# EAGLE board ESC_BOARD_NEW (EAGLE 8.5.0)
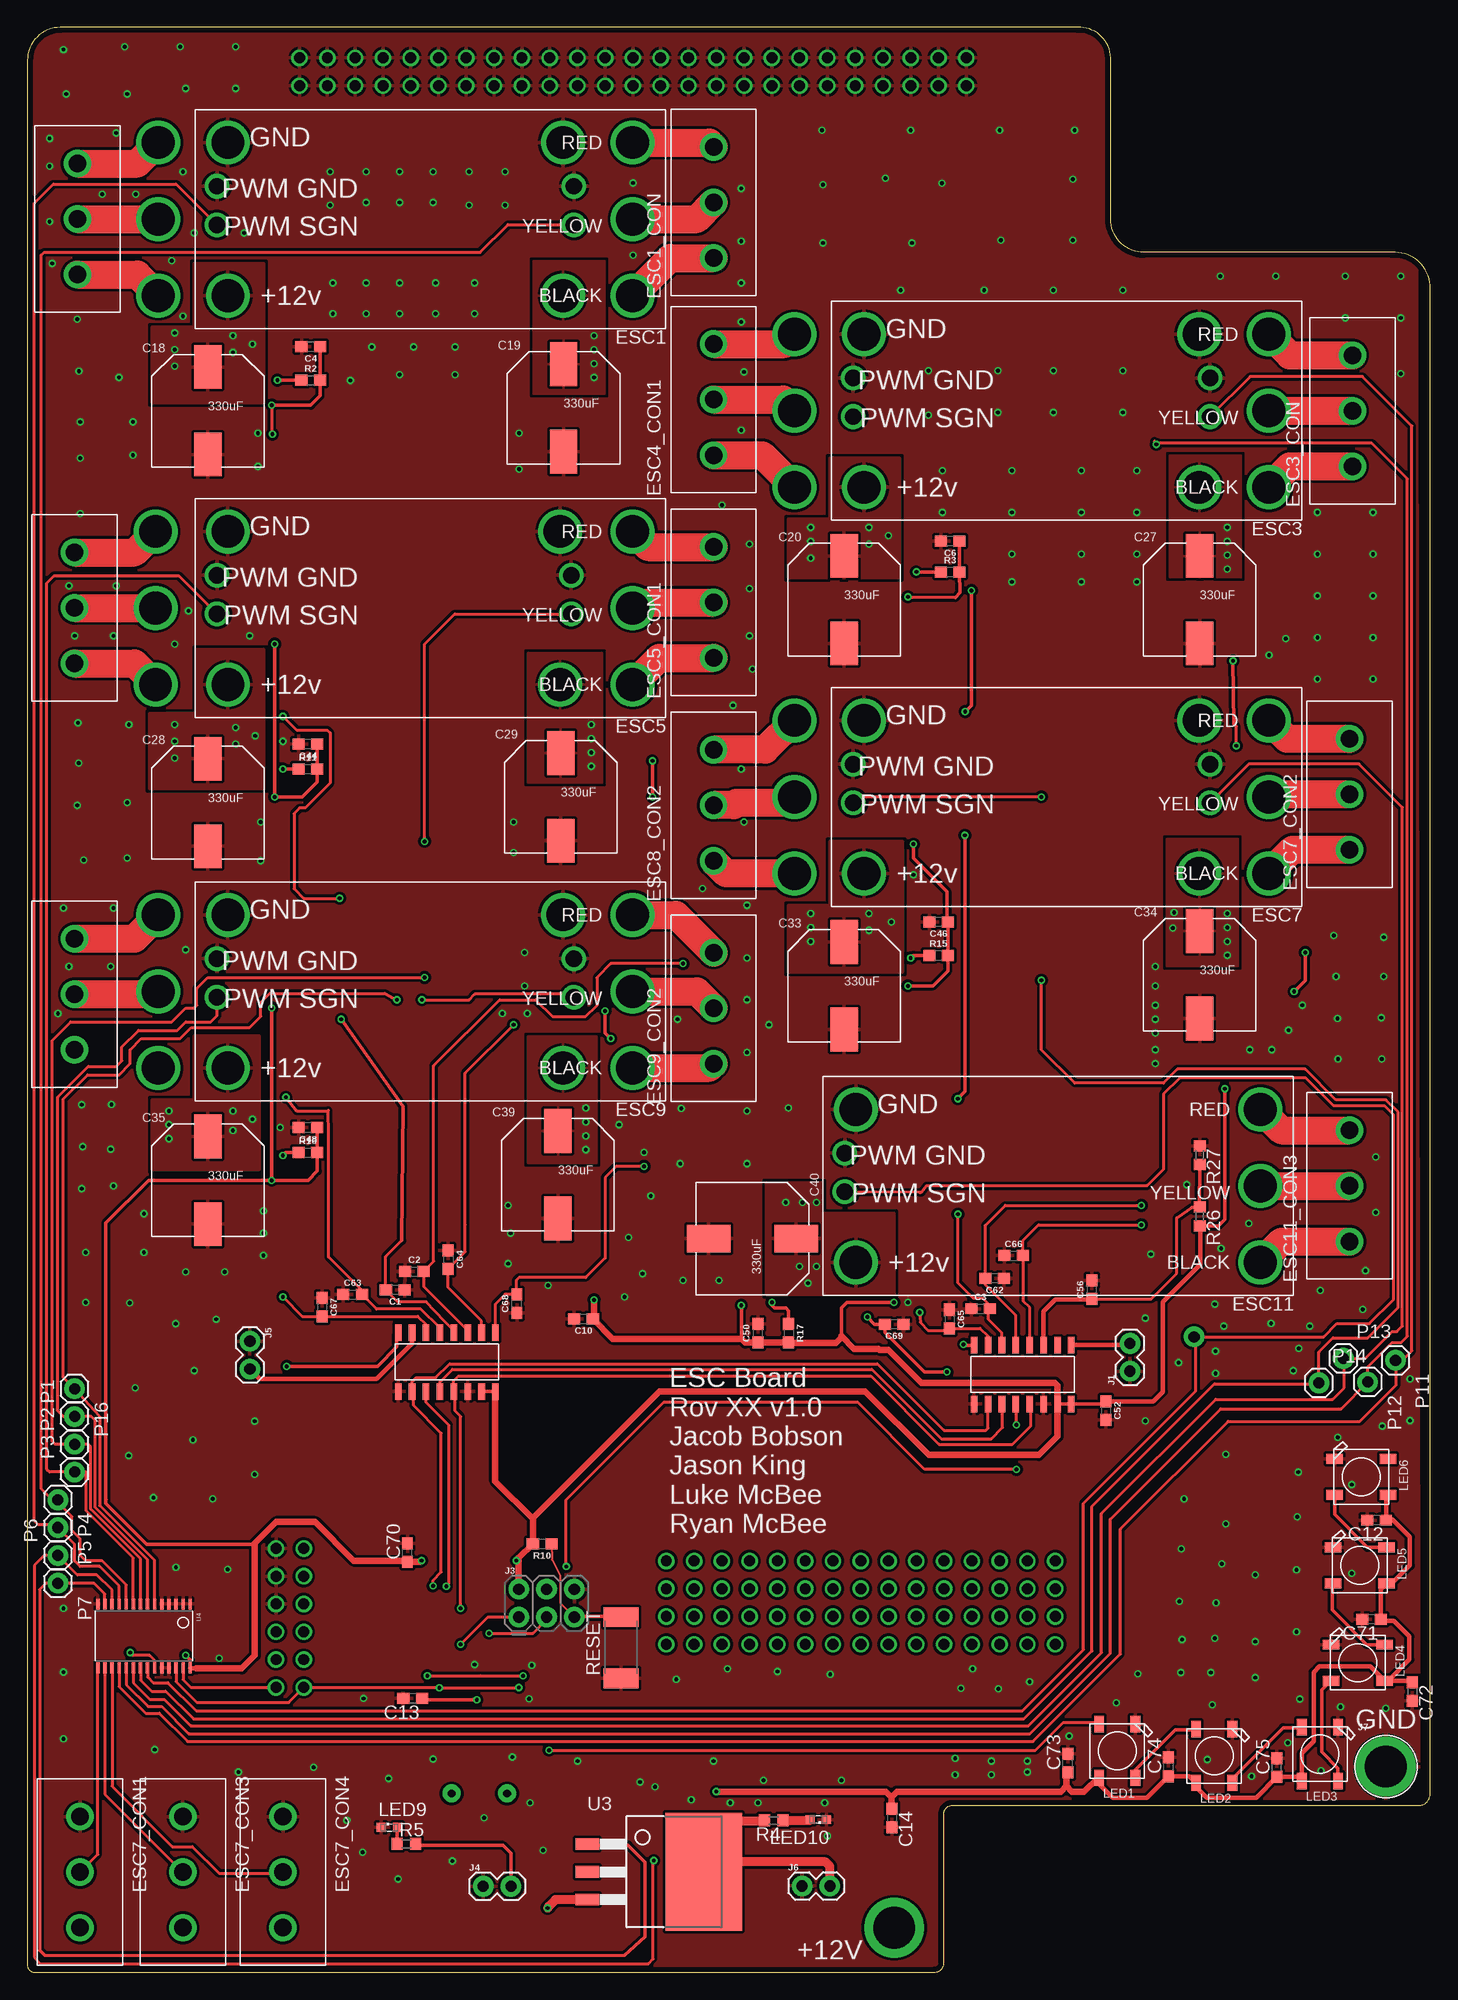
[diagram p2: board, top side]
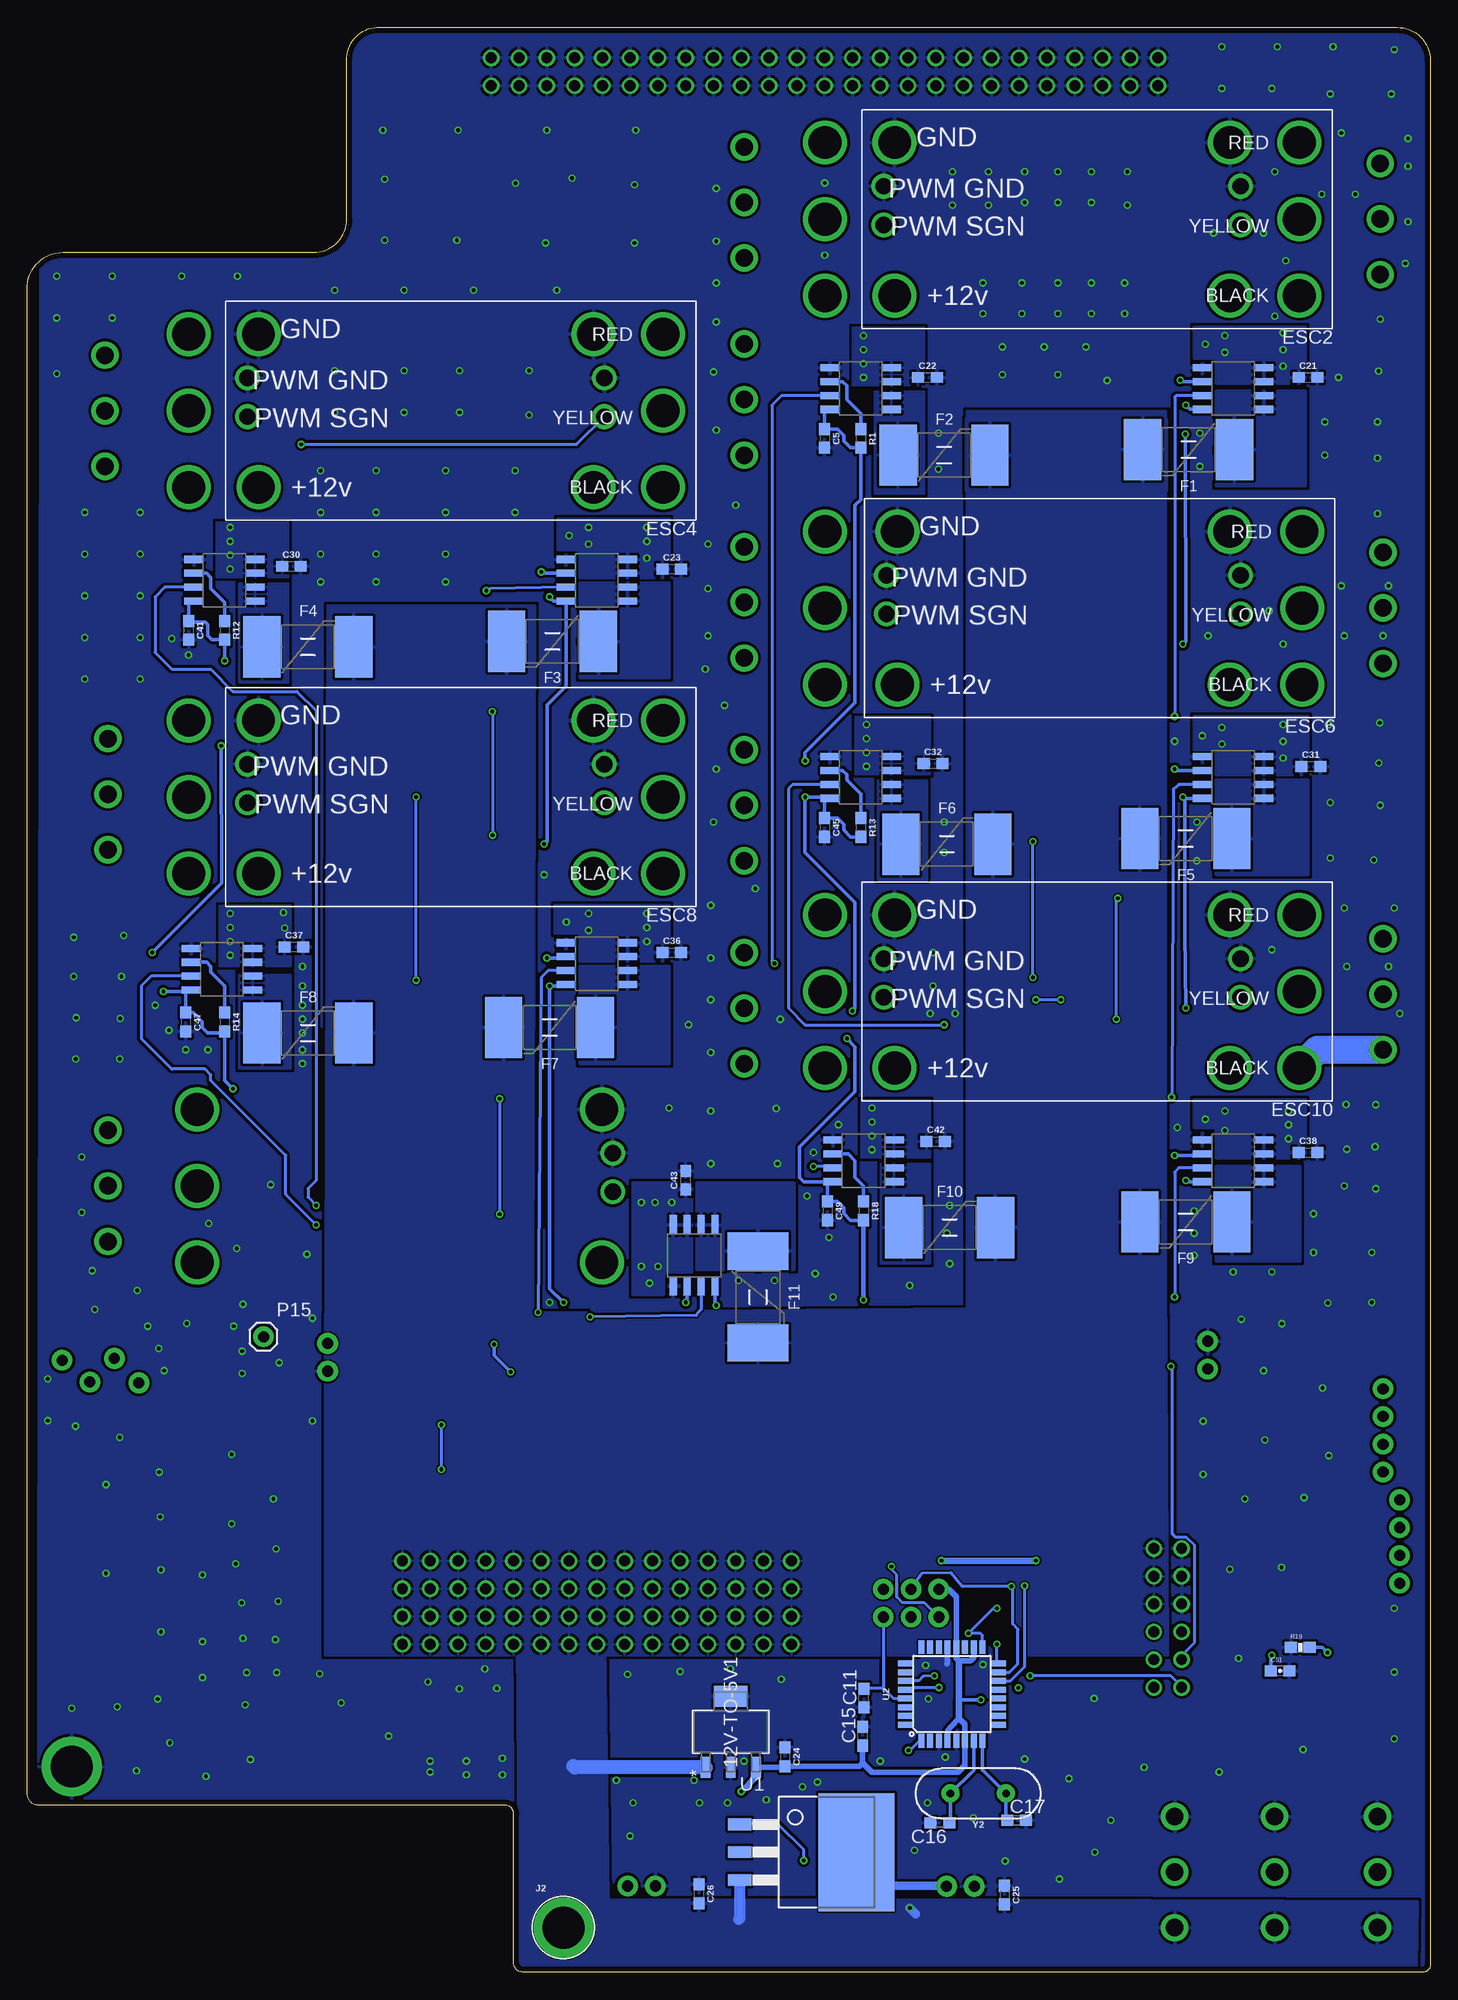
[diagram p3: board, bottom side, seen from below]

Size 128.27 x 177.8 mm. Coordinates in mm from the lower left corner, seen from the top.
Outline: 96.04,177.8 3.03,177.8 arc90 0,174.77 0,0.65 arc90 0.65,0 82.95,0 arc90 83.82,0.87 83.82,14.37 arc-90 84.43,15.24 127.2,15.24 arc90 128.27,16.31 128.27,154.21 arc90 124.75,157.23 102.08,157.23 arc-90 99.06,160.25 99.06,175.04 arc90 96.04,177.8
Copper layers (1*16): Top 0.035mm / dielectric 1.6mm / Bottom 0.035mm
Design rules "Elecrow_2-layer_PCB_eagle_rule": minimum track width 6mil, minimum drill 12mil, track to track 6mil, track to pad 6mil, pad to pad 6mil, via to via 8mil, smd to smd 0mil, copper to edge 20mil, drill to drill 10mil, minimum pad ring 6mil, minimum via ring 6mil, stop-mask expansion 0mil, vias tented up to drill 100mil, thermal gap 10mil

## Footprints (pad centres in the part's own frame; a part is rotated, then mirrored left to right if it is on the bottom)
MP04A-M = smd 1.905 x 0.889: 1 -3.251,2.3; 2 -3.251,0; 3 -3.251,-2.3 | smd 1.905 x 3.099: 4 3.251,0
0603 = smd 1.1 x 1: 1 -0.85,0; 2 0.85,0
C0603 = smd 1.1 x 1: 1 -0.85,0; 2 0.85,0
CPOL-US(10.3_10.3MM) = smd 2.5 x 4: + 0,4; - 0,-4
0603-CAP = smd 1.1 x 1: 1 -0.85,0; 2 0.85,0
AFRO_20A_ESC = drill 3: BLK -18,7; GND 19,-7; RED -18,-7; VCC 19,7; YEL -18,0 | drill 1.5: PWM_GND 20,-3; PWM_SGN 20,0.54
3PINCONNECTOR = drill 1.6 pad 2.5: A -5.08,0; B 0,0; C 5.08,0
PTC-2920 = smd 3.4 x 5.6: 1 -4.2,0; 2 4.2,0
1X02 = drill 1.016 pad 1.88: 1 0,0; 2 2.54,0
BANANA_CONN = drill 3.81 pad 5.461: P$1 0,0
2X3-NS = drill 1.016 pad 1.88: 1 -2.54,-1.27; 2 -2.54,1.27; 3 0,-1.27; 4 0,1.27; 5 2.54,-1.27; 6 2.54,1.27
WS2812B = smd 1.5 x 0.9: 1-VDD 2.45,-1.65; 2-DOUT 2.45,1.65; 3-GND -2.45,1.65; 4-DIN -2.45,-1.65
SML0603 = smd 0.8 x 0.8: A 0.75,0; C -0.75,0
1X01 = drill 1.016 pad 1.88: 1 0,0
R0603 = smd 1 x 1.1: 1 -0.85,0; 2 0.85,0
0603-RES = smd 1.1 x 1: 1 -0.85,0; 2 0.85,0
SW_2512 = smd 1.8 x 3.2: 1 -2.8,0; 2 2.8,0
TO263-3 = smd 1.067 x 2.159: 1 -2.54,-5.08; 2 0,-5.08; 3 2.54,-5.08 | smd 10.795 x 6.985: TAB 0,5.601
TQFP32-08 = smd 1.27 x 0.559: 1 -4.293,2.8; 2 -4.293,2; 3 -4.293,1.2; 4 -4.293,0.4; 5 -4.293,-0.4; 6 -4.293,-1.2; 7 -4.293,-2; 8 -4.293,-2.8; 17 4.293,-2.8; 18 4.293,-2; 19 4.293,-1.2; 20 4.293,-0.4; 21 4.293,0.4; 22 4.293,1.2; 23 4.293,2; 24 4.293,2.8 | smd 0.559 x 1.27: 9 -2.8,-4.293; 10 -2,-4.293; 11 -1.2,-4.293; 12 -0.4,-4.293; 13 0.4,-4.293; 14 1.2,-4.293; 15 2,-4.293; 16 2.8,-4.293; 25 2.8,4.293; 26 2,4.293; 27 1.2,4.293; 28 0.4,4.293; 29 -0.4,4.293; 30 -1.2,4.293; 31 -2,4.293; 32 -2.8,4.293
TSSOP28 = smd 0.305 x 0.991: 1 -4.225,-2.918; 2 -3.575,-2.918; 3 -2.925,-2.918; 4 -2.275,-2.918; 5 -1.625,-2.918; 6 -0.975,-2.918; 7 -0.325,-2.918; 8 0.325,-2.918; 9 0.975,-2.918; 10 1.625,-2.918; 11 2.275,-2.918; 12 2.925,-2.918; 13 3.575,-2.918; 14 4.225,-2.918; 15 4.225,2.918; 16 3.575,2.918; 17 2.925,2.918; 18 2.275,2.918; 19 1.625,2.918; 20 0.975,2.918; 21 0.325,2.918; 22 -0.325,2.918; 23 -0.975,2.918; 24 -1.625,2.918; 25 -2.275,2.918; 26 -2.925,2.918; 27 -3.575,2.918; 28 -4.225,2.918
ACS711 = smd 1.75 x 0.65: FAULT 2.8,-0.635; GND 2.8,-1.905; IP1+ -2.8,1.905; IP1- -2.8,-0.635; IP2+ -2.8,0.635; IP2- -2.8,-1.905; VCC 2.8,1.905; VIOUT 2.8,0.635
MCP3008 = smd 0.6 x 1.5: AGND -1.905,2.7; CH0 -4.445,-2.7; CH1 -3.175,-2.7; CH2 -1.905,-2.7; CH3 -0.635,-2.7; CH4 0.635,-2.7; CH5 1.905,-2.7; CH6 3.175,-2.7; CH7 4.445,-2.7; CLK -0.635,2.7; CS/SHDN 3.175,2.7; DGND 4.445,2.7; DIN 1.905,2.7; DOUT 0.635,2.7; VDD -4.445,2.7; VREF -3.175,2.7
ESC-FULL = drill 1: P$1 -6.35,-1.27; P$2 -3.81,-1.27; P$3 -1.27,-1.27; P$4 1.27,-1.27; P$5 3.81,-1.27; P$6 6.35,-1.27; P$7 -6.35,1.27; P$8 -3.81,1.27; P$9 -1.27,1.27; P$10 1.27,1.27; P$11 3.81,1.27; P$12 6.35,1.27; P$13 140.081,-61.849; P$14 142.621,-61.849; P$15 140.081,-59.309; P$16 142.621,-59.309; P$17 140.081,-56.769; P$18 142.621,-56.769; P$19 140.081,-54.229; P$20 142.621,-54.229; P$21 140.081,-51.689; P$22 142.621,-51.689; P$23 140.081,-49.149; P$24 142.621,-49.149; P$25 140.081,-46.609; P$26 142.621,-46.609; P$27 140.081,-44.069; P$28 142.621,-44.069; P$29 140.081,-41.529; P$30 142.621,-41.529; P$31 140.081,-38.989; P$32 142.621,-38.989; P$33 140.081,-36.449; P$34 142.621,-36.449; P$35 140.081,-33.909; P$36 142.621,-33.909; P$37 140.081,-31.369; P$38 142.621,-31.369; P$39 140.081,-28.829; P$40 142.621,-28.829; P$41 140.081,-26.289; P$42 142.621,-26.289; P$43 140.081,-23.749; P$44 142.621,-23.749; P$45 140.081,-21.209; P$46 142.621,-21.209; P$47 140.081,-18.669; P$48 142.621,-18.669; P$49 140.081,-16.129; P$50 142.621,-16.129; P$51 140.081,-13.589; P$52 142.621,-13.589; P$53 140.081,-11.049; P$54 142.621,-11.049; P$55 140.081,-8.509; P$56 142.621,-8.509; P$57 140.081,-5.969; P$58 142.621,-5.969; P$59 140.081,-3.429; P$60 142.621,-3.429; P$61 140.081,-0.889; P$62 142.621,-0.889; P$63 2.667,-34.417; P$64 2.667,-36.957; P$65 2.667,-39.497; P$66 2.667,-42.037; P$67 2.667,-44.577; P$68 2.667,-47.117; P$69 2.667,-49.657; P$70 2.667,-52.197; P$71 2.667,-54.737; P$72 2.667,-57.277; P$73 2.667,-59.817; P$74 2.667,-62.357; P$75 2.667,-64.897; P$76 2.667,-67.437; P$77 2.667,-69.977; P$78 5.207,-34.417; P$79 5.207,-36.957; P$80 5.207,-39.497; P$81 5.207,-42.037; P$82 5.207,-44.577; P$83 5.207,-47.117; P$84 5.207,-49.657; P$85 5.207,-52.197; P$86 5.207,-54.737; P$87 5.207,-57.277; P$88 5.207,-59.817; P$89 5.207,-62.357; P$90 5.207,-64.897; P$91 5.207,-67.437; P$92 5.207,-69.977; P$101 -2.413,-34.417; P$102 -2.413,-36.957; P$103 -2.413,-39.497; P$104 -2.413,-42.037; P$105 -2.413,-44.577; P$106 -2.413,-47.117; P$107 -2.413,-49.657; P$108 -2.413,-52.197; P$109 -2.413,-54.737; P$110 -2.413,-57.277; P$111 -2.413,-59.817; P$112 -2.413,-62.357; P$113 -2.413,-64.897; P$114 -2.413,-67.437; P$115 -2.413,-69.977; P$116 0.127,-34.417; P$117 0.127,-36.957; P$118 0.127,-39.497; P$119 0.127,-42.037; P$120 0.127,-44.577; P$121 0.127,-47.117; P$122 0.127,-49.657; P$123 0.127,-52.197; P$124 0.127,-54.737; P$125 0.127,-57.277; P$126 0.127,-59.817; P$127 0.127,-62.357; P$128 0.127,-64.897; P$129 0.127,-67.437; P$130 0.127,-69.977
HC49US = drill 0.7 pad 1.651: 1 -2.54,0; 2 2.54,0

## Placement (x,y rotation side)
12V-TO-5V1  LM340MPX-5.0/NOPBMP04A-M  [MP04A-M]  63.96,21.97 90 bottom
C1  0.1uF  [0603]  33.63,62.38 180 top
C2  0.1uF  [0603]  35.38,64.06 0 top
C3  0.1uF  [0603]  87.15,60.66 0 top
C4  0.1uF  [0603]  25.91,148.59 180 top
C5  0.1uF  [0603]  55.37,140.21 270 bottom
C6  0.1uF  [0603]  84.38,130.81 180 top
C10  0.1uF  [0603]  50.85,59.72 180 top
C11  0.1uF  [C0603]  51.79,25.04 90 bottom
C12  0.1uF  [C0603]  123.37,41.33 180 top
C13  0.1uF  [C0603]  35.23,25.02 180 top
C14  0.1uF  [C0603]  79.04,14.1 270 top
C15  0.1uF  [C0603]  51.89,21.56 90 bottom
C16  22pF  [C0603]  44.83,13.67 180 bottom
C17  22pF  [C0603]  37.82,13.87 0 bottom
C18  330uF  [CPOL-US(10.3_10.3MM)]  16.51,142.75 0 top
C19  330uF  [CPOL-US(10.3_10.3MM)]  49.02,143 0 top
C20  330uF  [CPOL-US(10.3_10.3MM)]  74.68,125.48 0 top
C21  0.1uF  [0603]  11.18,145.8 0 bottom
C22  0.1uF  [0603]  45.97,145.8 0 bottom
C23  0.1uF  [0603]  69.34,128.27 0 bottom
C24  0.1uF  [0603]  59,19.68 270 bottom
C25  0.1uF  [0603]  38.94,7.06 270 bottom
C26  10uF  [0603]  66.88,7.16 270 bottom
C27  330uF  [CPOL-US(10.3_10.3MM)]  107.19,125.48 0 top
C28  330uF  [CPOL-US(10.3_10.3MM)]  16.51,106.93 0 top
C29  330uF  [CPOL-US(10.3_10.3MM)]  48.77,107.44 0 top
C30  0.1uF  [0603]  104.14,128.52 0 bottom
C31  0.1uF  [0603]  10.92,110.24 0 bottom
C32  0.1uF  [0603]  45.47,110.49 0 bottom
C33  330uF  [CPOL-US(10.3_10.3MM)]  74.68,90.17 0 top
C34  330uF  [CPOL-US(10.3_10.3MM)]  107.19,91.19 0 top
C35  330uF  [CPOL-US(10.3_10.3MM)]  16.51,72.39 0 top
C36  0.1uF  [0603]  69.34,93.22 0 bottom
C37  0.1uF  [0603]  103.89,93.73 0 bottom
C38  0.1uF  [0603]  11.18,74.93 0 bottom
C39  330uF  [CPOL-US(10.3_10.3MM)]  48.51,72.9 0 top
C40  330uF  [CPOL-US(10.3_10.3MM)]  66.29,67.06 270 top
C41  0.1uF  [0603]  113.54,122.68 270 bottom
C42  0.1uF  [0603]  45.21,75.95 0 bottom
C43  0.1uF  [0603]  68.07,72.39 90 bottom
C44  0.1uF  [0603]  25.65,112.27 180 top
C45  0.1uF  [0603]  55.37,104.65 270 bottom
C46  0.1uF  [0603]  83.31,96.01 180 top
C47  0.1uF  [0603]  113.79,86.87 270 bottom
C48  0.1uF  [0603]  25.65,77.22 180 top
C49  0.1uF  [0603]  55.12,69.6 270 bottom
C50  0.1uF  [0603]  66.8,58.42 90 top
C51  10uF  [0603-CAP]  13.72,27.56 0 bottom
C52  0.1uF  [0603]  98.6,51.33 270 top
C56  0.1uF  [0603]  97.33,62.41 90 top
C62  0.1uF  [0603]  88.44,63.42 180 top
C63  0.1uF  [0603]  29.74,61.95 0 top
C64  0.1uF  [0603]  38.48,65.15 270 top
C65  0.1uF  [0603]  84.3,59.72 270 top
C66  0.1uF  [0603]  90.17,65.51 0 top
C67  0.1uF  [0603]  26.95,60.81 270 top
C68  0.1uF  [0603]  44.75,61.11 90 top
C69  0.1uF  [0603]  79.25,59.23 180 top
C70  0.1uF  [C0603]  34.75,38.35 90 top
C71  0.1uF  [C0603]  122.89,32.26 180 top
C72  0.1uF  [C0603]  126.62,25.65 270 top
C73  0.1uF  [C0603]  95.12,19.1 90 top
C74  0.1uF  [C0603]  104.34,18.77 90 top
C75  0.1uF  [C0603]  114.25,18.69 90 top
ESC1  AFRO_20A_ESC  [AFRO_20A_ESC]  37.34,160.27 180 top
ESC1_CON  3PINCONNECTOR  [3PINCONNECTOR]  62.74,161.8 90 top
ESC2  AFRO_20A_ESC  [AFRO_20A_ESC]  29.97,160.27 180 bottom
ESC2_CON  3PINCONNECTOR  [3PINCONNECTOR]  4.57,160.27 90 top
ESC3  AFRO_20A_ESC  [AFRO_20A_ESC]  95.5,142.75 180 top
ESC3_CON  3PINCONNECTOR  [3PINCONNECTOR]  121.16,142.75 90 top
ESC4  AFRO_20A_ESC  [AFRO_20A_ESC]  88.14,142.75 180 bottom
ESC4_CON1  3PINCONNECTOR  [3PINCONNECTOR]  62.74,143.76 90 top
ESC5  AFRO_20A_ESC  [AFRO_20A_ESC]  37.34,124.71 180 top
ESC5_CON1  3PINCONNECTOR  [3PINCONNECTOR]  62.74,125.22 90 top
ESC6  AFRO_20A_ESC  [AFRO_20A_ESC]  29.72,124.71 180 bottom
ESC6_CON1  3PINCONNECTOR  [3PINCONNECTOR]  4.32,124.71 90 top
ESC7  AFRO_20A_ESC  [AFRO_20A_ESC]  95.5,107.44 180 top
ESC7_CON1  3PINCONNECTOR  [3PINCONNECTOR]  4.83,9.14 270 top
ESC7_CON2  3PINCONNECTOR  [3PINCONNECTOR]  120.9,107.7 90 top
ESC7_CON3  3PINCONNECTOR  [3PINCONNECTOR]  14.22,9.14 270 top
ESC7_CON4  3PINCONNECTOR  [3PINCONNECTOR]  23.37,9.14 270 top
ESC8  AFRO_20A_ESC  [AFRO_20A_ESC]  88.14,107.44 180 bottom
ESC8_CON2  3PINCONNECTOR  [3PINCONNECTOR]  62.74,106.68 90 top
ESC9  AFRO_20A_ESC  [AFRO_20A_ESC]  37.34,89.66 180 top
ESC9_CON2  3PINCONNECTOR  [3PINCONNECTOR]  62.74,88.14 90 top
ESC10  AFRO_20A_ESC  [AFRO_20A_ESC]  29.97,89.66 180 bottom
ESC10_CON3  3PINCONNECTOR  [3PINCONNECTOR]  4.32,89.41 90 top
ESC11  AFRO_20A_ESC  [AFRO_20A_ESC]  94.74,71.88 180 top
ESC11_CON3  3PINCONNECTOR  [3PINCONNECTOR]  120.9,71.88 90 top
F1  10A  [PTC-2920]  22.1,139.19 180 bottom
F2  10A  [PTC-2920]  44.45,138.68 0 bottom
F3  10A  [PTC-2920]  80.26,121.67 180 bottom
F4  10A  [PTC-2920]  102.62,121.16 0 bottom
F5  10A  [PTC-2920]  22.35,103.63 180 bottom
F6  10A  [PTC-2920]  44.2,103.12 0 bottom
F7  10A  [PTC-2920]  80.52,86.36 180 bottom
F8  10A  [PTC-2920]  102.62,85.85 0 bottom
F9  10A  [PTC-2920]  22.35,68.58 180 bottom
F10  10A  [PTC-2920]  43.94,68.07 0 bottom
F11  10A  [PTC-2920]  61.47,61.72 270 bottom
J1  [1X02]  100.81,54.94 90 top
J2  [BANANA_CONN]  79.25,4.06 0 bottom
J3  AVR_SPI_PROG_3X2NS  [2X3-NS]  47.47,33.73 0 top
J4  [1X02]  41.68,7.85 0 top
J5  [1X02]  20.35,57.68 270 top
J6  [1X02]  70.84,7.87 0 top
J7  [BANANA_CONN]  124.21,18.8 0 top
LED1  WS2812B5050  [WS2812B]  99.64,20.22 270 top
LED2  WS2812B5050  [WS2812B]  108.51,19.76 270 top
LED3  WS2812B5050  [WS2812B]  118.19,19.94 270 top
LED4  WS2812B5050  [WS2812B]  121.64,28.3 0 top
LED5  WS2812B5050  [WS2812B]  121.82,37.19 0 top
LED6  WS2812B5050  [WS2812B]  121.97,45.29 0 top
LED9  [SML0603]  33.1,13.23 0 top
LED10  [SML0603]  72.31,13.94 180 top
P1  [1X01]  4.32,50.8 90 top
P2  [1X01]  4.32,48.26 90 top
P3  [1X01]  4.32,45.72 90 top
P4  [1X01]  2.79,43.18 270 top
P5  [1X01]  2.79,40.64 270 top
P6  [1X01]  2.79,38.1 90 top
P7  [1X01]  2.79,35.56 270 top
P11  [1X01]  125.09,55.93 270 top
P12  [1X01]  122.56,53.95 270 top
P13  [1X01]  120.32,56.11 0 top
P14  [1X01]  118.08,53.87 0 top
P15  [1X01]  106.68,58.09 0 bottom
P16  [1X01]  4.32,53.34 270 top
R1  1k  [0603]  52.07,140.21 270 bottom
R2  1k  [0603]  25.91,145.54 0 top
R3  1k  [0603]  84.38,128.02 0 top
R4  330  [R0603]  68.25,13.87 180 top
R5  330  [R0603]  34.65,11.73 0 top
R10  10k  [0603]  47.07,39.14 180 top
R11  1k  [0603]  25.65,109.98 0 top
R12  1k  [0603]  110.24,122.68 270 bottom
R13  1k  [0603]  52.07,104.65 270 bottom
R14  1k  [0603]  110.24,86.87 270 bottom
R15  1k  [0603]  83.31,92.96 0 top
R16  1k  [0603]  25.65,74.93 0 top
R17  1k  [0603]  69.6,58.42 270 top
R18  1k  [0603]  51.82,69.6 270 bottom
R19  10k  [0603-RES]  11.89,29.69 0 bottom
R26  10k  [R0603]  107.19,69.09 270 top
R27  10k  [R0603]  107.19,74.68 270 top
RESET  [SW_2512]  54.28,29.67 90 top
U1  FQB27P06  [TO263-3]  58.06,10.97 270 bottom
U2  ATMEGA328P_TQFP  [TQFP32-08]  43.74,25.43 90 bottom
U3  FQB27P06  [TO263-3]  56.26,9.17 270 top
U4  PCA9685  [TSSOP28]  10.67,30.73 180 top
U$1  ACS711  [ACS711]  18.03,144.78 180 bottom
U$2  ACS711  [ACS711]  52.07,144.78 180 bottom
U$3  ACS711  [ACS711]  76.2,127.25 180 bottom
U$4  MCP3008  [MCP3008]  38.35,55.78 180 top
U$5  ACS711  [ACS711]  110.24,127.25 180 bottom
U$6  ACS711  [ACS711]  18.03,109.22 180 bottom
U$7  ACS711  [ACS711]  52.07,109.22 180 bottom
U$8  ACS711  [ACS711]  76.2,92.2 180 bottom
U$9  ACS711  [ACS711]  110.49,91.69 180 bottom
U$10  ACS711  [ACS711]  18.03,74.17 180 bottom
U$11  ACS711  [ACS711]  51.82,74.17 180 bottom
U$12  ACS711  [ACS711]  67.31,65.53 270 bottom
U$13  MCP3008  [MCP3008]  91.01,54.64 180 top
U$15  ESC-FULL  [ESC-FULL]  24,32.38 90 top
Y2  [HC49US]  41.33,16.33 180 bottom

## Tracks (layer width: path | path; a pad name or v marks a point on that pad's centre or on a via)
48_I_ANALOG  (via drill 0.35)
  Top 0.305: v23.72,55.37 32,55.37 33.78,57.15 33.78,58.35 U$4.CH7
  Bottom 0.254: v23.72,55.37 23.6,55.24 23.6,40.06 23.3,39.76 22.31,39.76 21.54,39 21.54,30.18 22.73,28.98 U$15.P$8
+5V  (via drill 0.35)
  Top 0.254: 7.19,43.18 7.21,43.18 | 20.65,39.29 20.8,39.14 | v110.54,112.12 110.54,113.89 110.31,114.12 | v22.35,143.26 22.35,140.66 v22.4,140.61
  Top 0.305: U$4.VDD U$4.VREF | U$13.VREF U$13.VDD 98.36,51.94 C52.1 | C48.1 R16.2 26.5,73.24 25.65,72.39 v22.35,72.39 | C4.1 R2.2 26.76,144.11 25.91,143.26 v22.35,143.26 | C44.1 R11.2 26.5,108.8 25.15,107.44 v22.61,107.44 v22.61,121.41 | C6.1 R3.2 85.25,126.12 84.86,125.68 v80.52,125.73 | v80.52,90.17 82.8,90.17 84.16,91.53 R15.2 C46.1 84.07,96.1 84.07,98.81 81.03,101.85 v81.03,103.12 | 66.64,57.4 C50.1 | 65.28,57.91 v65.28,60.96 | v22.35,88.14 v22.35,72.39 | v57.15,110.74 v57.15,107.44 | v52.83,87.88 52.83,85.85 v53.34,85.34 | v79.25,61.21 74.93,61.21 74.42,60.71 74.42,58.17 | 110.31,114.12 v110.24,119.89 | v116.84,93.22 116.84,90.68 v115.82,89.66 | v109.47,80.77 109.47,68.83 108.88,68.24 R26.2 | v22.35,72.39 11.1,72.39 7.19,68.48 7.19,43.18 7.19,42.85 10.92,39.12 20.78,39.12 20.8,39.14 | v41.1,24.89 36.21,24.89 C13.1 | U4.28 14.89,28.54 v14.48,28.96
  Top 0.406: 15.44,27.76 14.95,27.76 U4.28 | LED1.1-VDD 97.99,17.22 99.26,15.95 102.37,15.95 C74.1 106.25,17.92 LED2.1-VDD 106.86,16.94 107.85,15.95 112.36,15.95 C75.1 116.18,17.84 LED3.1-VDD 116.54,20.02 117.6,21.08 117.6,27.43 118.11,27.94 122.8,27.94 LED4.1-VDD | LED4.1-VDD 124.41,26.65 126.36,28.59 126.36,30.69 124.92,32.13 123.86,32.13 C71.1 123.73,35 LED5.1-VDD 124.77,35.54 126.4,37.17 126.4,39.79 124.82,41.38 124.27,41.38 | 124.27,41.38 C12.1 | 124.27,41.38 124.27,43.49 LED6.1-VDD | C52.1 102.96,52.18 103.83,53.06 103.83,61.29 107.26,64.72 107.26,68.16 R26.2 | LED4.1-VDD 126.48,26.65 C72.1
  Top 0.61: J3.2 44.93,37.86 | 44.93,37.86 R10.2 46.22,41.44 | 46.22,41.44 42.77,44.88 42.77,53.05 U$4.VDD | 46.22,41.44 46.22,41.54 57.78,53.11 76.61,53.11 82.45,47.27 92.48,47.27 94.18,48.97 U$13.VREF 94.18,53.65 93.95,53.87 81.76,53.87 78.74,56.9 77.9,56.9 77.8,57 75.59,57 74.42,58.17 74.42,58.01 73.94,57.53 69.64,57.53 R17.2 C50.1 65.62,57.57 65.28,57.91 53.5,57.91 C10.1 51.82,59.83 v51.82,61.47 | 44.93,37.86 v44.69,37.62 v44.7,37.62 | 15.44,27.76 19.61,27.76 20.8,28.96 20.8,39.14 20.8,39.19 22.76,41.15 26.31,41.15 29.84,37.62 34.63,37.62 C70.1 | LED1.1-VDD 97.07,16.97 96.61,16.51 95.5,16.51 95,17.02 | 34.91,37.5 C70.1 | C70.1 35.93,37.5 v36.04,37.62 | 95,17.02 94.49,16.51 79.5,16.51 78.99,16 | 95,17.02 95,18.12 C73.1 | 78.99,16 78.99,15 C14.1 | 78.99,16 78.49,16.51 v62.99,16.51
  Bottom 0.254: 55.37,72.26 U$11.VCC | 44.02,35 J3.2 | U2.20 43.31,29.7 | 41.74,29.15 U2.18
  Bottom 0.305: R13.2 53,103.8 53.59,104.39 53.59,104.9 54.19,105.5 C45.1 55.37,107.31 | U$6.VCC 22.48,107.31 v22.61,107.44 22.45,107.29 22.45,95.12 v22.35,88.14 | U$1.VCC 21.97,142.88 v22.35,143.26 | U$10.VCC 22.48,72.26 v22.35,72.39 | R18.2 53,68.75 53.59,69.34 53.59,69.85 54.19,70.45 C49.1 55.12,72.26 U$11.VCC | v80.52,125.73 80.14,125.35 U$3.VCC 79,117.6 80.77,115.82 80.77,103.38 v81.03,103.12 | U$8.VCC 79.13,90.17 v80.52,90.17 80.52,62.48 v79.25,61.21 | U$12.VCC 65.41,61.09 v65.28,60.96 | 113.79,89.79 U$9.VCC | 113.79,89.79 C47.1 113.12,87.72 112.27,86.87 112.27,86.36 111.76,85.85 110.4,85.85 R14.2 110.24,81.53 v109.47,80.77 | U$5.VCC 113.54,125.35 C41.1 113.45,123.44 112.01,123.44 111.76,123.19 111.76,122.17 111.42,121.83 R12.2 v110.24,119.89 | 55.37,107.31 U$7.VCC | U$2.VCC 55.37,142.88 C5.1 54.19,141.06 53.59,140.46 53.59,139.95 53,139.36 R1.2 52.07,134.62 52.58,134.11 52.58,116.08 57.15,111.51 v57.15,110.74 | v22.4,140.61 22.35,121.67 v22.61,121.41 | 55.37,107.31 55.5,107.44 v57.15,107.44 57.15,102.36 52.58,97.79 52.58,88.14 v52.83,87.88 | 55.37,72.26 57.28,72.26 57.66,72.64 57.66,75.44 52.58,80.52 52.58,84.58 v53.34,85.34 | v110.54,112.12 110.49,99.57 v116.84,93.22 | v115.82,89.66 113.92,89.66 113.79,89.79 | 43.08,24.92 41.27,24.92 41.25,24.89 v41.1,24.89 | C51.1 14.57,28.87 v14.48,28.96
  Bottom 0.406: R18.2 v51.82,61.47
  Bottom 0.508: 44.02,35 43.33,34.31 U2.20 | U2.4 44.12,21.15 44.12,22.1 44.09,22.12 43.84,22.43 43.08,23.19 42.54,22.65 U2.6 | U2.18 41.74,28.77 42.04,28.47 43.08,28.47 43.36,28.75 43.36,29.65 43.31,29.7 | U2.6 | U2.6 42.54,18.93 43.18,18.29 51.05,18.29 51.89,19.13 | C15.1 51.89,19.13 | 51.89,19.13 52.18,18.84 C24.2 59.12,18.72 12V-TO-5V1.3
  Bottom 0.61: 43.08,28.47 43.08,24.92 43.08,23.19 | v44.7,37.62 v36.04,37.62 | 12V-TO-5V1.3 61.66,17.84 v62.99,16.51
+12V  (via drill 0.35)
  Top 0.813: U3.3 48.28,6.63 47.7,6.04 47.7,5.99 v47.57,5.87
  Bottom 0.813: v47.57,5.87 47.57,5.84 47.04,5.31
  Bottom 1.016: U1.3 63.14,4.9 63.22,4.83
  Bottom 1.27: 12V-TO-5V1.1 78.21,18.72 78.33,18.85
  pour Bottom: 24.13,141.99 24.13,135.38 42.42,135.38 42.42,141.99
  pour Bottom: 24.38,71.37 42.16,71.37 42.16,64.52 24.38,64.52
  pour Bottom: 82.8,89.15 100.84,89.15 100.84,82.55 82.8,82.55
  pour Bottom: 24.89,106.43 42.16,106.43 42.16,99.57 24.89,99.57
  pour Bottom: 82.04,124.46 100.58,124.46 100.58,117.6 82.04,117.6
  pour Bottom: 24.13,142.75 42.42,142.75 42.42,64.26 24.13,64.26
  pour Bottom: 81.79,124.97 100.84,124.97 101.09,47.24 82.04,47.24
  pour Bottom: 24.13,64.26 23.93,28.91 101.09,28.93 101.09,60.2 42.42,60.71 42.42,64.26
  pour Bottom: 75.51,30.18 83.46,30.35 83.24,0.13 1.27,0.51 1.17,6.45 49.96,6.6 75.18,6.55
CS  (via drill 0.35)
  Top 0.254: v37.08,35.31 37.08,35.81 37.85,36.58 37.85,49.28 35.31,51.82 35.31,52.95 U$4.CS/SHDN 35.18,53.98 35.56,54.36 37.34,54.36 38.61,55.63 77.72,55.63 83.82,49.53 87.63,49.53 87.83,49.73 U$13.CS/SHDN
  Bottom 0.254: U2.14 38.4,26.62 37.08,27.94 v37.08,35.31
CUR1  (via drill 0.35)
  Top 0.254: v23.37,114.81 24.64,113.54 27.43,113.54 27.69,113.28 27.69,108.71 25.4,106.43 24.89,106.43 24.38,105.92 24.38,99.06 25.27,98.17 v28.55,98.17 | U$4.CH3 38.99,58.65 38.13,59.51 36.48,61.29 36.2,61.29 33.87,61.29 C1.2 32.78,65.42 34.24,66.88
  Top 0.305: v28.7,87.12 34.34,79.15 34.24,66.88
  Bottom 0.254: U$1.VIOUT 23.24,144.15 23.37,144.02 v23.37,114.81 | v28.7,87.12 28.7,97.8 arc45 v28.55,98.17
CUR2  (via drill 0.35)
  Top 0.254: v59.94,92.2 53.34,92.2 52.07,90.93 52.07,88.39 51.05,87.38 48.01,87.38 46.48,88.9 43.18,88.9 37.16,82.88 37.16,64.99 C2.2 36.27,64.02 36.27,62.66 40.26,58.67 U$4.CH2
  Bottom 0.254: U$2.VIOUT 59.31,144.15 60.2,143.26 60.2,92.46 v59.94,92.2
CUR3  (via drill 0.35)
  Top 0.254: v85.09,69.29 85.09,62.99 86.49,61.59 87.35,61.59 88,60.95 C3.2 87.88,60.54 87.88,59.66 89.1,58.45 U$13.CH5
  Top 0.305: v85.72,103.94 85.72,80.49 v85.09,79.86 | v86.31,126.31 86.31,115.8 v85.75,115.24
  Bottom 0.254: U$3.VIOUT 85.9,126.49 v86.31,126.31 | v85.75,115.24 v85.72,103.94 | v85.09,79.86 v85.09,69.29
CUR4  (via drill 0.35)
  Top 0.254: v101.85,70.1 89.41,70.1 87.59,68.29 C62.2 87.61,63.41 87.61,62.81 90.37,60.05 U$13.CH4
  Bottom 0.254: U$5.VIOUT 115.7,126.62 116.59,125.73 116.59,120.65 115.06,119.13 111.51,119.13 109.47,117.09 103.63,117.09 101.85,115.32 101.85,72.39 102.62,71.63 102.62,70.87 v101.85,70.1
CUR5  (via drill 0.35)
  Top 0.254: v23.65,79.98 24.64,78.74 27.51,78.74 27.51,78.79 27.53,76.61 27.53,65.38 30.59,62.32 C63.2 31.91,60.63 35.97,60.63 37.72,58.88 U$4.CH4
  Bottom 0.254: U$6.VIOUT 22.99,108.58 23.5,108.15 v23.65,79.98
CUR6  (via drill 0.35)
  Top 0.254: U$4.CH1 41.53,59.54 38.46,62.61 38.46,64.28 C64.2 40.03,65.85 40.03,68.33 | 40.03,68.33 40.03,68.35 | 40.03,68.33 40.03,82.19 v44.45,86.61
  Bottom 0.254: U$7.VIOUT 58.29,108.58 58.67,108.2 58.67,88.14 57.15,86.61 v44.45,86.61
CUR7  (via drill 0.35)
  Top 0.254: U$13.CH6 87.81,57.36 87.81,58.17 87.11,58.87 C65.2 84.11,58.67 82.32,58.67 81.64,59.41 v81.58,60.33
  Bottom 0.254: U$8.VIOUT 80.64,91.57 81.28,90.93 v81.58,60.33
CUR8  (via drill 0.35)
  Top 0.254: v101.85,68.33 92.46,68.33 91.02,66.89 C66.2 91.08,65.44 91.08,61.32 91.64,60.76 U$13.CH3
  Bottom 0.254: U$9.VIOUT 116.97,91.06 117.86,90.17 117.86,85.34 115.06,82.55 112.01,82.55 111.51,82.04 111.51,81.53 104.65,74.68 104.65,71.12 v101.85,68.33
CUR9  (via drill 0.35)
  Top 0.254: v23.37,61.72 25.15,59.94 26.94,59.94 C67.2 35.7,59.96 36.45,59.21 U$4.CH5
  Bottom 0.254: U$10.VIOUT 22.99,73.53 23.37,73.15 v23.37,61.72
CUR10  (via drill 0.35)
  Top 0.254: 44.7,61.96 43.67,61.96 42.8,61.09 U$4.CH0 | 44.7,61.96 C68.2 | 44.7,61.96 44.7,63.25 44.96,63.5 51.05,63.5 52.83,65.28 52.83,72.64 53.85,73.66 v56.39,73.66
  Bottom 0.254: U$11.VIOUT 54.74,73.66 v56.39,73.66
CUR11  (via drill 0.35)
  Top 0.254: 86.5,57.28 U$13.CH7
  Top 0.305: v76.81,59.89 77.47,59.23 C69.2 78.4,58.51 82.04,54.86 v84.07,54.86 | v85.6,57.4 85.72,57.28 86.5,57.28
  Bottom 0.254: U$12.VIOUT 66.67,60.58 67.13,60.02 v76.81,59.89
  Bottom 0.305: v84.07,54.86 85.6,56.39 v85.6,57.4
E1
  Top 0.406: U$4.CH6 35.18,57.48 31.95,54.25 21.23,54.25 J5.2
E3
  Top 0.406: U$13.CH0 101.16,57.34 J1.2
E_MAG_1
  Top 0.305: J4.2 44.22,10.85 43.48,11.58 35.65,11.58 R5.2
  Bottom 0.813: J4.2 49.39,7.9 U1.TAB
E_MAG_1_ON  (via drill 0.35)
  Top 0.254: 1.28,37.83 1.29,37.85 | 1.28,37.83 0.64,37.19 0.64,1.37 1.17,0.79 56.79,0.79 57.23,1.22 57.23,10.16 v57.28,10.21 | U4.12 7.74,34.93 6.35,36.32 4.57,36.32 P6.1 1.55,38.1 1.28,37.83
  Bottom 0.254: v57.28,10.21 57.28,11.18 59.66,13.56 63.09,13.56 U1.1
E_MAG_2
  Top 0.813: 62.01,8.84 U3.TAB | J6.2 73.38,9.68 72.97,10.08 62.78,10.08 U3.TAB | U3.TAB 61.86,10.5 65.18,13.82 67.35,13.82 R4.2
E_MAG_2_ON
  Top 0.254: 1.12,2.01 1.12,34.98 1.7,35.56 P7.1 6.1,35.56 7.09,34.56 U4.13 | 1.6,1.55 54.61,1.55
  Top 0.305: 1.12,2.01 1.6,1.55 | 54.61,1.55 56.49,3.25 56.49,10.06 54.94,11.61 51.28,11.61 U3.1
ESC1  (via drill 0.35)
  other vias: 13.46,149.86 13.46,148.34 13.46,146.81 18.8,149.61 18.8,148.08 20.57,148.84
  pour Top: 15.24,156.21 21.59,156.21 21.59,143.51 11.43,143.51 11.43,150.37 15.24,150.37
  pour Bottom: 11.43,150.37 21.59,150.37 21.59,147.57 19.56,147.57 19.56,145.29 11.43,145.29
ESC2  (via drill 0.35)
  other vias: 51.82,149.61 51.82,148.34 51.82,147.07 51.82,145.8
  pour Top: 46.23,144.27 52.83,144.27 52.83,156.46 46.23,156.46
  pour Bottom: 52.83,145.03 46.23,145.03 46.23,150.37 52.83,150.37
ESC3  (via drill 0.35)
  other vias: 71.63,132.08 71.63,130.81 71.63,129.29 76.96,132.08 76.96,130.56 78.74,131.32
  pour Bottom: 69.6,132.84 79.76,132.84 79.76,130.05 77.72,130.05 77.72,127.51 69.6,127.51
  pour Top: 73.41,138.43 79.76,138.43 79.76,127.51 69.6,127.51 69.6,132.84 73.41,132.84
ESC4  (via drill 0.35)
  other vias: 109.73,132.08 109.73,130.81 109.73,129.54 109.73,128.27
  pour Top: 104.39,138.68 111,138.68 111,127.51 104.39,127.51
  pour Bottom: 104.39,127.51 104.39,132.59 111,132.59 111,127.51
ESC5  (via drill 0.35)
  other vias: 19.05,113.79 13.46,111 13.46,112.52 13.46,114.05 19.05,112.27 20.83,113.03
  pour Top: 15.49,115.06 15.49,120.9 21.59,120.9 21.59,108.2 11.18,108.2 11.18,115.06
  pour Bottom: 11.18,109.47 11.18,114.81 21.59,114.81 21.59,111.76 19.56,111.76 19.56,109.47
ESC6  (via drill 0.35)
  other vias: 51.56,114.05 51.56,112.78 51.56,111.51 51.56,110.24
  pour Bottom: 45.72,109.47 45.72,114.81 52.58,114.81 52.58,109.47
  pour Top: 45.72,120.65 45.72,108.71 52.58,108.71 52.58,120.65
ESC7  (via drill 0.35)
  other vias: 71.63,96.77 71.63,95.5 71.63,94.23 76.96,96.77 76.96,95.25 78.99,96.01
  pour Bottom: 69.6,97.54 80.01,97.54 80.01,95 77.72,95 77.72,92.46 69.6,92.46
  pour Top: 73.41,97.54 73.41,103.38 80.01,103.38 80.01,91.44 69.6,91.44 69.6,97.54
ESC8  (via drill 0.35)
  other vias: 109.73,96.77 109.73,95.5 109.73,94.23 109.73,92.96 104.85,96.88 104.75,95.45
  pour Top: 104.14,103.63 110.74,103.63 110.74,91.95 104.14,91.95
  pour Bottom: 104.14,97.54 110.74,97.54 110.74,91.95 104.14,91.95
ESC9  (via drill 0.35)
  other vias: 12.95,78.74 12.95,77.47 20.57,77.98 18.8,78.74 12.95,76.2 18.8,76.96
  pour Bottom: 11.43,79.76 11.43,74.42 19.56,74.42 19.56,77.22 21.59,77.22 21.59,79.76
  pour Top: 21.21,73.41 11.43,73.41 11.43,79.76 15.24,79.76 15.24,85.6 21.21,85.6
ESC10  (via drill 0.35)
  other vias: 51.05,78.99 51.05,77.72 51.05,76.45 51.05,75.18
  pour Top: 45.72,85.6 52.07,85.6 52.07,73.91 45.72,73.91
  pour Bottom: 45.72,79.76 52.07,79.76 52.07,74.42 45.72,74.42
ESC11  (via drill 0.35)
  other vias: 72.14,70.36 70.87,70.36 69.34,70.36 71.37,62.99 70.61,64.52 72.14,64.52
  pour Bottom: 67.56,72.14 72.9,72.14 72.9,61.98 70.1,61.98 70.1,64.01 67.56,64.01
  pour Top: 67.56,61.98 67.56,72.14 72.64,72.14 72.64,69.34 79.25,69.34 79.25,61.98
GND  (via drill 0.35)
  Bottom 0.508: U2.21 44.14,28.25 44.2,28.19
  other vias: 54.1,77.47 56.39,74.93 43.94,64.77 45.72,87.63 45.47,90.17 45.47,93.22 19.3,18.29 17.53,28.7 81.03,100.33 111.76,84.33 115.32,86.11 116.59,88.39 113.79,84.33 103.12,87.12 103.12,85.85 103.12,84.33 103.12,83.06 103.12,88.39 103.12,91.95 103.12,90.17 113.54,120.4 115.06,121.92 23.37,112.52 80.52,61.21 21.59,65.53 21.59,67.56 21.59,69.6 3.3,33.27 3.3,27.43 3.3,21.34 10.67,69.34 10.67,65.79 14.48,64.01 18.03,64.01 21.34,105.16 21.34,101.6 9.14,106.93 9.14,101.85 21.08,140.72 21.08,137.67 9.65,141.73 9.65,138.68 44.96,140.72 44.96,137.41 44.45,105.16 44.45,102.36 43.94,70.1 44.2,67.56 59.94,63.25 63.25,63.25 47.6,62.79 54.61,61.72 59.69,73.91 65.79,73.91 65.79,78.74 65.79,84.07 65.79,88.9 65.79,92.71 65.79,97.54 61.72,99.06 65.53,105.16 65.28,109.98 64.52,115.82 66.29,119.13 66.04,122.17 66.04,126.49 66.04,130.56 63.5,134.11 65.28,140.97 65.53,146.3 65.28,150.88 65.28,154.43 65.28,158.24 65.28,163.07 34.04,164.59 34.04,154.43 34.04,146.05 4.57,151.13 4.83,141.73 4.83,138.43 105.46,27.38 108.2,27.38 105.59,30.4 108.56,30.51 108.69,33.76 105.33,33.91 99.57,24.61 108.36,24.43 116.36,24.97 116.05,31.11 116.05,36.78 116.13,41.63 116.2,45.72 47.17,11.15 41.76,14.1 33.05,17.7 33.91,8.51 30.66,10.97 4.57,106.68 4.7,110.54 4.62,114.22 9.3,114.05 5.16,101.68 4.98,79.3 119.84,83.49 123.85,83.49 123.8,87.25 119.79,87.17 119.66,91.03 124.03,91.03 119.46,94.77 124.03,94.61 5.05,75.46 4.98,71.63 7.62,75.23 4.72,146.35 29.54,145.52 59.79,78.97 13.56,59.28 9.86,53.42 9.27,47.22 11.53,43.38 16.94,43.28 20.78,45.52 20.78,50.37 15.14,48.67 15.24,54.99 9.37,61.19 13.59,37.01 18.31,36.83 11.63,20.35 56.03,17.37 57.4,16.94 59.33,26.77 85.34,25.96 88.77,25.91 91.64,26.54 86.44,27.74 101.55,27.28 30.99,154.43 27.94,154.43 37.34,154.43 40.89,154.43 27.94,151.64 30.99,151.64 34.04,151.64 37.34,151.64 40.89,151.64 30.99,164.59 27.69,164.59 27.69,161.54 30.99,161.8 34.04,161.8 37.08,161.8 37.08,164.59 40.39,164.59 40.39,161.54 43.69,161.54 43.69,164.59 73.41,27.23 68.58,27.48 64.01,27.74 44.35,19.66 45.87,24.99 46.13,28.04 7.7,79.32 54.97,67.16 57,70.97 56.24,63.86 123.29,74.52 123.29,69.44 118.21,62.33 108.56,61.06 102.72,65.63 106.02,71.98 102.21,59.79 105.26,55.73 102.21,50.39 105.77,43.28 109.58,47.35 109.58,41 105.51,38.71 72.75,158.09 80.87,158.09 89,158.34 95.61,158.34 95.61,163.93 78.46,164.01 83.62,163.55 72.75,163.42 82.4,142.34 88.75,142.6 93.83,142.6 100.18,142.6 100.18,146.41 93.83,146.41 88.75,146.41 82.4,146.41 83.67,137.26 90.02,137.26 96.37,137.26 101.45,137.26 101.45,133.45 96.37,133.45 90.02,133.45 83.67,133.45 90.02,129.64 96.37,129.64 101.45,129.64 101.45,127.1 96.37,127.1 90.02,127.1 117.96,133.45 123.04,133.45 123.04,129.64 117.96,129.64 117.96,125.83 123.04,125.83 123.04,122.02 117.96,122.02 117.96,118.21 123.04,118.21 125.58,146.15 125.58,151.23 120.5,151.23 120.5,155.04 125.58,155.04 114.15,155.04 109.07,155.04 100.18,153.77 93.83,153.77 87.48,153.77 79.86,153.77 31.5,148.59 35.31,148.59 39.12,148.59 39.12,146.05 2.03,160.02 2.03,165.1 2.03,167.64 6.86,162.56 15.24,159 19.81,159 2.29,156.21 13.21,156.46 14.22,151.38 8.38,145.8 4.83,133.35 4.32,122.17 7.87,122.17 8.13,126.75 3.81,126.75 13.46,121.41 14.73,124.46 20.32,122.17 14.48,93.47 7.62,91.95 3.81,91.95 2.79,87.63 3.3,97.28 7.87,97.28 5.33,61.21 5.33,65.79 7.87,71.88 38.86,10.16 73.15,12.45 72.9,15.49 66.8,15.49 45.97,15.49 50.29,19.3 62.74,19.3 74.42,17.53 67.31,17.53 84.84,19.56 84.84,18.03 95.25,21.59 91.44,19.3 88.14,19.3 88.14,18.03 91.44,18.29 112.27,26.92 112.27,30.23 112.27,36.32 109.22,37.34 124.21,24.13 107.87,19.43 118.29,18.41 120.07,24.26 121.08,36.45 121.08,44.58 119.81,48.9 126.42,54.23 126.42,50.42 123.88,49.91 116.26,57.02 108.64,54.74 108.64,56.77 115.75,54.99 117.27,59.05 109.4,59.05 113.72,59.31 122.35,64.14 122.1,60.58 111.68,68.45 109.14,66.17 3.3,175.77 3.56,171.7 8.89,176.02 9.14,171.7 13.97,176.02 14.48,172.21 19.05,176.02 19.05,172.21 8.13,168.15 14.22,164.59 9.91,162.56 55.37,163.58 55.37,156.97 69.6,78.99 67.82,86.61 59.44,87.12 43.43,87.63 23.11,77.22 17.27,59.69 72.64,168.4 80.77,168.4 88.9,168.4 95.76,168.4 64.26,15.49 60.71,15.75 29.21,13.89 26.16,18.72 37.08,19.48 40.89,28.12 115.24,20.95 111.94,17.91 30.73,25.02
  pour Top (isolate 0.254, rank 6): 0.25,-0.25 0,179.07 127,179.07 127.25,-0.25
  pour Bottom (isolate 0.254, rank 6): 0.25,-0.25 127.25,-0.25 127,179.07 0,179.07
LED1
  Top 0.254: U4.15 6.44,10.76 ESC7_CON1.B
LED2
  Top 0.254: U4.16 7.09,16.27 ESC7_CON3.B
MISO  (via drill 0.35)
  Top 0.254: U$13.DOUT 90.37,50.09 v90.42,50.04 | v90.42,45.97 82.04,45.97 75.95,52.07 58.17,52.07 49.28,43.18 v49.28,37.08 | v39.62,29.97 42.11,32.46 J3.1
  Bottom 0.254: v90.42,50.04 v90.42,45.97 | U2.16 39.62,28.4 v39.62,29.97 | J3.1 46.25,33.78 48.26,33.78 48.77,34.29 48.77,36.32 49.28,36.83 v49.28,37.08
MOSI  (via drill 0.35)
  Top 0.254: U$4.DIN 36.45,52.09 38.53,50.01 38.53,35.51 v38.3,35.28
  Bottom 0.254: U2.15 38.46,27.43 37.72,28.17 37.69,31.34 38.18,31.83 38.18,35.15 v38.3,35.28 42.8,35.26 43.84,36.52 46.46,36.47 47.17,35.51 47.35,35.15 J3.4
N$1
  Top 2.54: ESC2_CON.C 10.05,165.35 ESC2.RED
N$2  (via drill 0.35)
  Top 0.305: v22.86,145.54 R2.1
  Bottom 0.305: U$1.FAULT 22.73,145.41 v22.86,145.54
N$3
  Top 2.54: ESC2_CON.B ESC2.YEL
N$4
  Bottom 0.305: R1.1 52.07,142.49 53.34,143.76 53.34,145.03 53.72,145.41 U$2.FAULT
N$5
  Top 2.54: ESC2_CON.A 10.05,155.19 ESC2.BLK
N$6  (via drill 0.35)
  Top 0.305: v81.28,128.02 R3.1
  Bottom 0.305: U$3.FAULT 81.15,127.89 v81.28,128.02
N$7
  Top 2.54: ESC1.RED 62.34,167.27 ESC1_CON.C
N$8
  Top 2.54: ESC1.YEL 61.21,160.27 ESC1_CON.B
N$9
  Top 2.54: ESC1.BLK 58.78,156.72 ESC1_CON.A
N$10
  Top 2.54: ESC3.RED 115.42,147.83 ESC3_CON.C
N$11
  Top 2.54: ESC3.YEL ESC3_CON.B
N$12
  Top 2.54: ESC3.BLK 115.42,137.67 ESC3_CON.A
N$13
  Bottom 0.305: U$5.FAULT 111.89,127.89 111.51,127.51 111.51,126.49 110.24,125.22 R12.1
N$14
  Bottom 0.305: U2.7 41.74,18.46 Y2.2 43.87,13.78 C16.1
N$15
  Bottom 0.305: U2.8 40.94,18.44 40.89,18.44 Y2.1 38.79,13.98 C17.1
N$16
  Top 2.54: ESC5.RED 56.75,130.3 ESC5_CON1.C
N$17
  Top 2.54: ESC5.YEL 55.85,125.22 ESC5_CON1.B
N$18
  Top 2.54: ESC5.BLK 57.77,120.14 ESC5_CON1.A
N$19
  Top 2.54: ESC4_CON1.C 69.23,148.84 ESC4.RED
N$20
  Top 2.54: ESC4_CON1.B 69.12,143.76 ESC4.YEL
N$21
  Top 2.54: ESC4_CON1.A 67.2,138.68 ESC4.BLK
N$22
  Top 2.54: ESC6_CON1.C 9.8,129.79 ESC6.RED
N$23
  Top 2.54: ESC6_CON1.B ESC6.YEL
N$24
  Top 2.54: ESC6_CON1.A 9.8,119.63 ESC6.BLK
N$25
  Top 2.54: ESC8.RED 67.46,111.76 ESC8_CON2.C
N$26
  Top 2.54: ESC8_CON2.B 64.58,106.68 64.81,106.91 69.6,106.91 ESC8.YEL
N$27
  Top 2.54: ESC8.BLK 63.9,100.44 ESC8_CON2.A
N$28
  Top 2.54: ESC7.RED 115.17,112.78 ESC7_CON2.C
N$29
  Top 2.54: ESC7.YEL 113.76,107.7 ESC7_CON2.B
N$30
  Top 2.54: ESC7.BLK 115.68,102.62 ESC7_CON2.A
N$31
  Top 2.54: ESC9.RED 59.29,96.66 ESC9_CON2.C
N$32
  Top 2.54: ESC9.YEL 61.21,89.66 ESC9_CON2.B
N$33
  Top 2.54: ESC9.BLK 62.34,82.66 ESC9_CON2.A
N$34
  Top 2.54: ESC11.RED 114.66,76.96 ESC11_CON3.C
N$35
  Top 2.54: ESC11.YEL ESC11_CON3.B
N$36
  Top 2.54: ESC11.BLK 114.66,66.8 ESC11_CON3.A
N$37
  Top 2.54: ESC10_CON3.C 9.8,94.49 ESC10.RED
N$38
  Top 2.54: ESC10_CON3.B 11.72,89.41 ESC10.YEL
N$39
  Bottom 2.54: ESC10_CON3.A 10.31,84.33 ESC10.BLK
N$40  (via drill 0.35)
  Top 0.305: v23.37,109.98 R11.1
  Bottom 0.305: U$6.FAULT 23.24,109.86 v23.37,109.98
N$41
  Bottom 0.305: U$7.FAULT 53.72,109.86 53.34,109.47 53.34,108.97 52.07,107.7 R13.1
N$42  (via drill 0.35)
  Top 0.305: v80.77,92.71 81.03,92.96 R15.1
  Bottom 0.305: U$8.FAULT 79.13,92.71 v80.77,92.71
N$43
  Bottom 0.305: U$9.FAULT 111.89,92.33 111.51,91.95 111.51,91.44 110.24,90.17 R14.1
N$44  (via drill 0.35)
  Top 0.305: v23.37,74.68 23.62,74.93 R16.1
  Bottom 0.305: U$10.FAULT 20.96,74.68 v23.37,74.68
N$45
  Bottom 0.305: U$11.FAULT 53.21,74.8 52.58,74.17 52.58,72.64 51.82,71.88 R18.1
N$46  (via drill 0.35)
  Top 0.305: v68.07,61.21 68.07,60.96 68.33,60.71 69.34,60.71 69.6,60.45 R17.1
  Bottom 0.305: U$12.FAULT 67.94,61.21 v68.07,61.21
N$51
  Top 0.305: R5.1 33.8,13.18 LED9.A
N$52
  pour Bottom: 45.97,108.97 50.55,108.97 50.55,99.82 45.97,99.82
N$53
  pour Bottom: 11.43,144.53 19.56,144.53 19.56,135.89 11.43,135.89
N$54
  pour Bottom: 46.23,135.13 46.23,144.53 50.8,144.53 50.8,135.13
N$55
  pour Bottom: 69.6,127 77.72,127 77.72,118.36 69.6,118.36
N$56
  pour Bottom: 104.39,127 108.97,127 108.97,117.86 104.39,117.86
N$57
  pour Bottom: 11.18,108.97 19.56,108.97 19.56,100.33 11.18,100.33
N$58
  pour Bottom: 69.6,91.95 69.6,83.06 77.72,83.06 77.72,91.95
N$59  (via drill 0.35)
  Top 0.254: U4.23 11.64,28.49 11.18,28.96 9.65,28.96 v9.4,29.21
  Bottom 0.305: v9.4,29.21 9.88,29.69 R19.2
N$60
  pour Bottom: 104.14,91.19 108.97,91.19 108.97,82.55 104.14,82.55
N$61
  pour Bottom: 19.56,65.02 11.94,65.02 11.94,73.66 19.56,73.66
N$62
  pour Bottom: 45.72,73.91 50.29,73.91 50.29,64.77 45.72,64.77
N$63
  pour Bottom: 58.17,64.26 67.06,64.26 67.06,72.14 58.17,72.14
N$64
  Top 0.813: R4.1 71.49,13.87 LED10.A
OUT1
  Top 0.305: LED1.2-DOUT 101.29,18.49 104.98,22.17 106.82,22.17 LED2.4-DIN
OUT2
  Top 0.305: LED2.2-DOUT 110.16,17.68 114.83,22.35 116.5,22.35 LED3.4-DIN
OUT3
  Top 0.305: LED3.2-DOUT 119.84,18.64 118.34,20.14 118.34,25.79 LED4.4-DIN
OUT4
  Top 0.305: LED4.2-DOUT 122.48,29.95 119.3,33.12 119.3,35.47 LED5.4-DIN
OUT5
  Top 0.305: LED5.2-DOUT 122.53,38.84 119.53,41.83 119.53,43.63 LED6.4-DIN
PD3  (via drill 0.35)
  Top 0.254: v47.71,20.3 92.18,20.3 94.72,22.84 97.83,22.84 LED1.4-DIN
  Bottom 0.254: U2.1 46.71,21.13 47.45,20.4 47.6,20.4 v47.71,20.3
PIEZO
  Top 0.254: U4.17 7.74,17 13.26,11.48 15.09,11.48 17.53,9.04 23.27,9.04 ESC7_CON4.B
PWM1
  Top 0.254: ESC1.PWM_SGN 13.6,163.47 2.39,163.47 0.64,161.72 0.64,41.27 1.02,40.89 2.54,40.89 P5.1 4.32,39.12 4.32,37.59 4.83,37.08 6.6,37.08 8.39,35.3 U4.11 8.38,33.66
PWM2
  Top 0.254: U4.10 9.04,35.41 6.86,37.59 5.33,37.59 4.83,38.1 4.83,39.62 4.06,40.39 4.06,41.66 2.79,42.93 P4.1 2.29,43.18 1.27,44.2 1.27,156.97 1.52,157.23 41.4,157.23 43.94,159.77 49.94,159.77 ESC2.PWM_SGN
PWM3  (via drill 0.35)
  Top 0.254: U4.19 9.04,26.29 11.05,24.28 12.27,24.28 14.76,21.79 91.67,21.79 99.01,29.13 99.01,41.4 109.12,51.51 120.12,51.51 P12.1 122.56,55.32 124.79,57.56 125.6,57.56 126.18,58.13 126.18,136.53 122.91,139.8 103.23,139.8 103.05,139.98 103.05,139.85 v103.23,139.68
  Bottom 0.254: v103.23,139.68 78.04,139.68 ESC3.PWM_SGN
PWM4
  Top 0.254: U4.18 8.39,26.1 10.82,23.67 12.06,23.67 14.66,21.08 91.95,21.08 99.95,29.08 99.95,40.51 109.8,50.37 121.84,50.37 125.15,53.67 125.15,55.88 P11.1 125.7,55.93 126.58,56.81 126.58,141.36 122.07,145.87 111.8,145.87 ESC4.PWM_SGN
PWM5
  Top 0.254: ESC5.PWM_SGN 13.85,127.66 2.44,127.66 1.78,127 1.78,45.97 2.03,45.72 P3.1 5.33,45.72 5.38,45.67 5.38,42.17 9.69,37.86 U4.9
PWM6  (via drill 0.35)
  Top 0.254: v36.32,103.38 36.32,121.41 39.08,124.17 ESC6.PWM_SGN | v36.32,90.93 16.51,90.93 15.49,89.92 15.49,88.39 15.24,88.14 14.48,88.14 13.21,86.87 3.96,86.87 2.29,85.19 2.29,48.51 2.54,48.26 P2.1 5.59,48.26 5.79,48.06 5.79,42.34 10.34,37.78 U4.8
  Bottom 0.254: v36.32,90.93 v36.32,103.38
PWM7  (via drill 0.35)
  Top 0.254: U4.21 10.34,26.69 11.35,25.68 12.65,25.68 15.19,23.14 91.11,23.14 97.33,29.36 97.33,42.6 108.53,53.8 118.01,53.8 P14.1 118.08,56.69 119.38,57.99 122.56,57.99 125.32,60.76 125.32,78.64 124.21,79.76 119.63,79.76 116.84,82.55 105.16,82.55 103.89,81.28 95.76,81.28 92.71,84.33 v92.71,90.68 | v92.71,107.44 76.04,107.44 ESC7.PWM_SGN
  Bottom 0.254: v92.71,90.68 v92.71,107.44
PWM8
  Top 0.254: U4.20 9.69,26.45 11.2,24.94 12.52,24.94 14.94,22.53 91.54,22.53 98.22,29.21 98.22,41.94 108.66,52.38 119.36,52.38 120.4,53.42 120.4,56.03 P13.1 122.33,56.11 124.79,58.57 125.22,58.57 125.73,59.08 125.73,106.48 121.74,110.47 111.7,110.47 ESC8.PWM_SGN
PWM9
  Top 0.254: ESC9.PWM_SGN 17.34,87.44 16.76,86.87 14.48,86.87 13.72,86.11 10.16,86.11 8.64,84.58 8.64,83.31 8.13,82.8 5.59,82.8 2.79,80.01 2.79,51.31 3.3,50.8 P1.1 5.84,50.8 6.2,50.44 6.2,42.5 10.99,37.71 U4.7
PWM10  (via drill 0.35)
  Top 0.254: v33.78,88.9 32.69,89.48 22.17,89.48 21.34,88.65 21.34,87.38 20.32,86.36 14.99,86.36 13.97,85.34 10.41,85.34 9.4,84.33 9.4,83.06 8.38,82.04 5.51,82.04 3.3,79.83 3.3,54.36 P16.1 6.6,50.8 6.6,42.67 11.64,37.63 U4.6 | v36.07,88.9 40.39,88.9 40.89,89.41 49.53,89.41 | 49.53,89.41 | ESC10.PWM_SGN 49.82,89.12 49.53,89.41
  Bottom 0.254: v33.78,88.9 v36.07,88.9
PWM11
  Top 0.254: ESC11.PWM_SGN 81.6,71.27 arc45 81.78,71.34 82.22,71.88 102.26,71.88 arc45 102.44,71.96 103.89,73.41 103.89,80.26 105.41,81.79 116.84,81.79 117.74,80.89 117.86,80.77 119.43,79.2 124.1,79.2 124.92,78.38 124.92,61.52 122.71,59.31 119.74,59.31 118.52,58.09 P15.1 106.83,57.94 106.83,53.14 96.57,42.88 96.57,29.49 90.96,23.88 15.44,23.88 12.85,26.47 11.51,26.47 10.99,26.98 U4.22
RESET
  Top 0.203: R10.1 47.97,37.73 48.72,36.27 48.72,33.76 J3.5
  Top 0.305: J3.5 50.06,32.51 54.86,32.51 54.82,32.47 RESET.2
  Bottom 0.254: J3.5 50.01,25.96 | 50.01,25.96 49.1,25.04 48.05,25.04 U2.29 | 50.01,25.96 51.73,25.96 C11.2
SCK  (via drill 0.35)
  Top 0.254: U$4.CLK | U$4.CLK 38.99,54.08 39.42,54.51 77.11,54.51 83.36,48.26 90.07,48.26 91.75,49.94 91.75,51.83 U$13.CLK | 39.01,53.05 U$4.CLK | 38.99,52.65 U$4.CLK | v42.22,30.99 46.23,30.99 47.47,32.23 J3.3 | v39.62,33.27 39.62,50.8 39.12,51.31 39.12,52.96 U$4.CLK
  Bottom 0.254: 40.87,29.79 U2.17 40.94,30.78 41.15,30.99 v42.22,30.99 39.93,33.27 v39.62,33.27
SCL  (via drill 0.35)
  Top 0.254: U4.26 13.59,26.56 15.49,24.66 23.9,24.66 U$15.P$1 37.62,26.04 v37.67,25.98 v44.93,26.01
  Bottom 0.254: 37.62,26.04 v37.67,25.98 | v44.93,26.01 47.3,25.98 47.45,25.83 U2.28
SDA  (via drill 0.35)
  Top 0.254: U4.27 14.24,26.73 14.94,26.04 U$15.P$7 | v36.58,27.1 41.43,27.1 | 41.43,27.1 41.45,27.08 | 41.43,27.1 45.31,27.1 v45.34,27.08
  Bottom 0.254: v36.58,27.1 36.55,27.13 23.75,27.13 22.73,26.11 U$15.P$7 | v45.34,27.08 46.38,27.03 46.76,26.64 48.01,26.64 U2.27
TEMP1
  Top 0.254: 37.8,53 U$4.DOUT 37.72,53.98 38.86,55.12 77.22,55.12 83.57,48.77 88.14,48.77 89.15,49.78 89.15,51.88 U$13.DIN
TEMP11
  Top 0.254: 107.14,69.93 106.45,69.93 105.08,68.96 105.08,63.88 102.76,61.56 C56.1
  Top 0.305: R26.1 107.14,69.93 R27.2
  Top 0.406: U$13.CH2 92.91,60.43 94,61.52 97.29,61.52 C56.1

## Text on the board
tPlace: ESC Board / Rov XX v1.0 / Jacob Bobson / Jason King / Luke McBee / Ryan McBee | GND | +12V